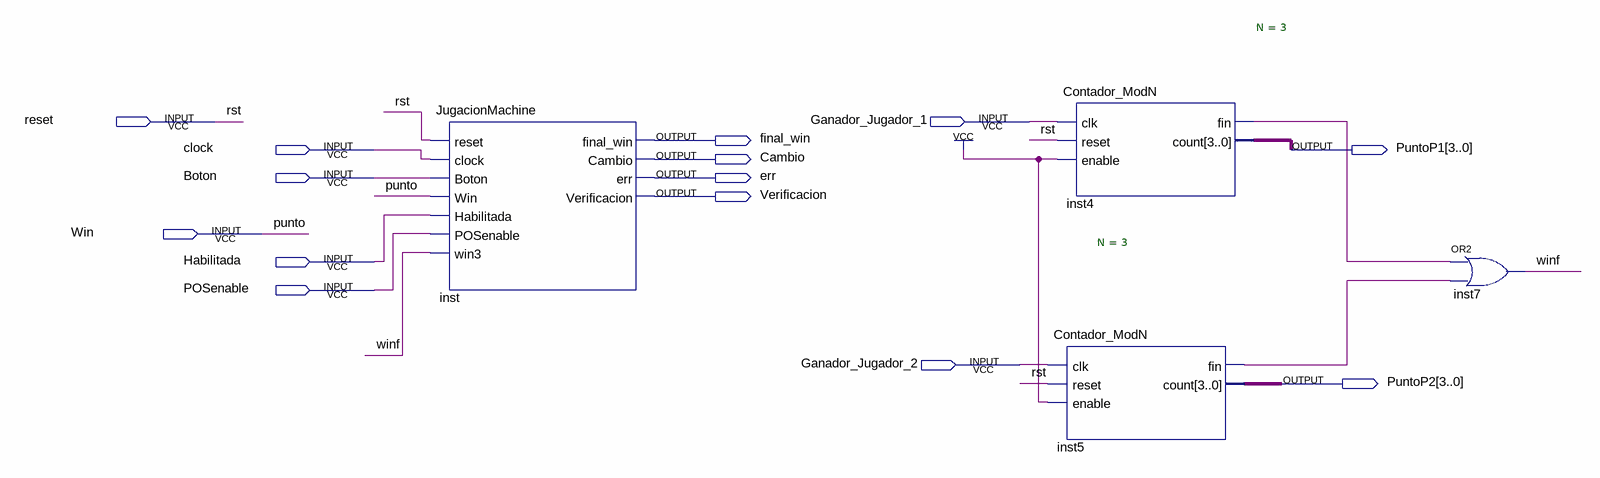
[diagram p0: schematic sheet]
// Quartus schematic Jugada1.bdf as structural Verilog: 4 symbols, 14 pins
module Jugada1 (
  input  reset,
  input  Ganador_Jugador_1,
  input  clock,
  input  Boton,
  input  Win,
  input  Habilitada,
  input  POSenable,
  input  Ganador_Jugador_2,
  output final_win,
  output [3:0] PuntoP1,
  output Cambio,
  output err,
  output Verificacion,
  output [3:0] PuntoP2
);

  wire inst4_fin, inst5_fin, winf;

  JugacionMachine inst (
    .reset(reset), .clock(clock), .Boton(Boton), .Win(Win), .Habilitada(Habilitada), .POSenable(POSenable),
    .win3(winf), .final_win(final_win), .Cambio(Cambio), .err(err), .Verificacion(Verificacion));
  Contador_ModN #(.N(3)) inst4 (
    .clk(Ganador_Jugador_1), .reset(reset), .enable(1'b1), .fin(inst4_fin), .count(PuntoP1));
  Contador_ModN #(.N(3)) inst5 (
    .clk(Ganador_Jugador_2), .reset(reset), .enable(1'b1), .fin(inst5_fin), .count(PuntoP2));
  or inst7 (winf, inst4_fin, inst5_fin);

  // Other names for the same wires on the sheet: punto = Win; rst = reset
endmodule
